# Altium project dakPCB.PrjPcb
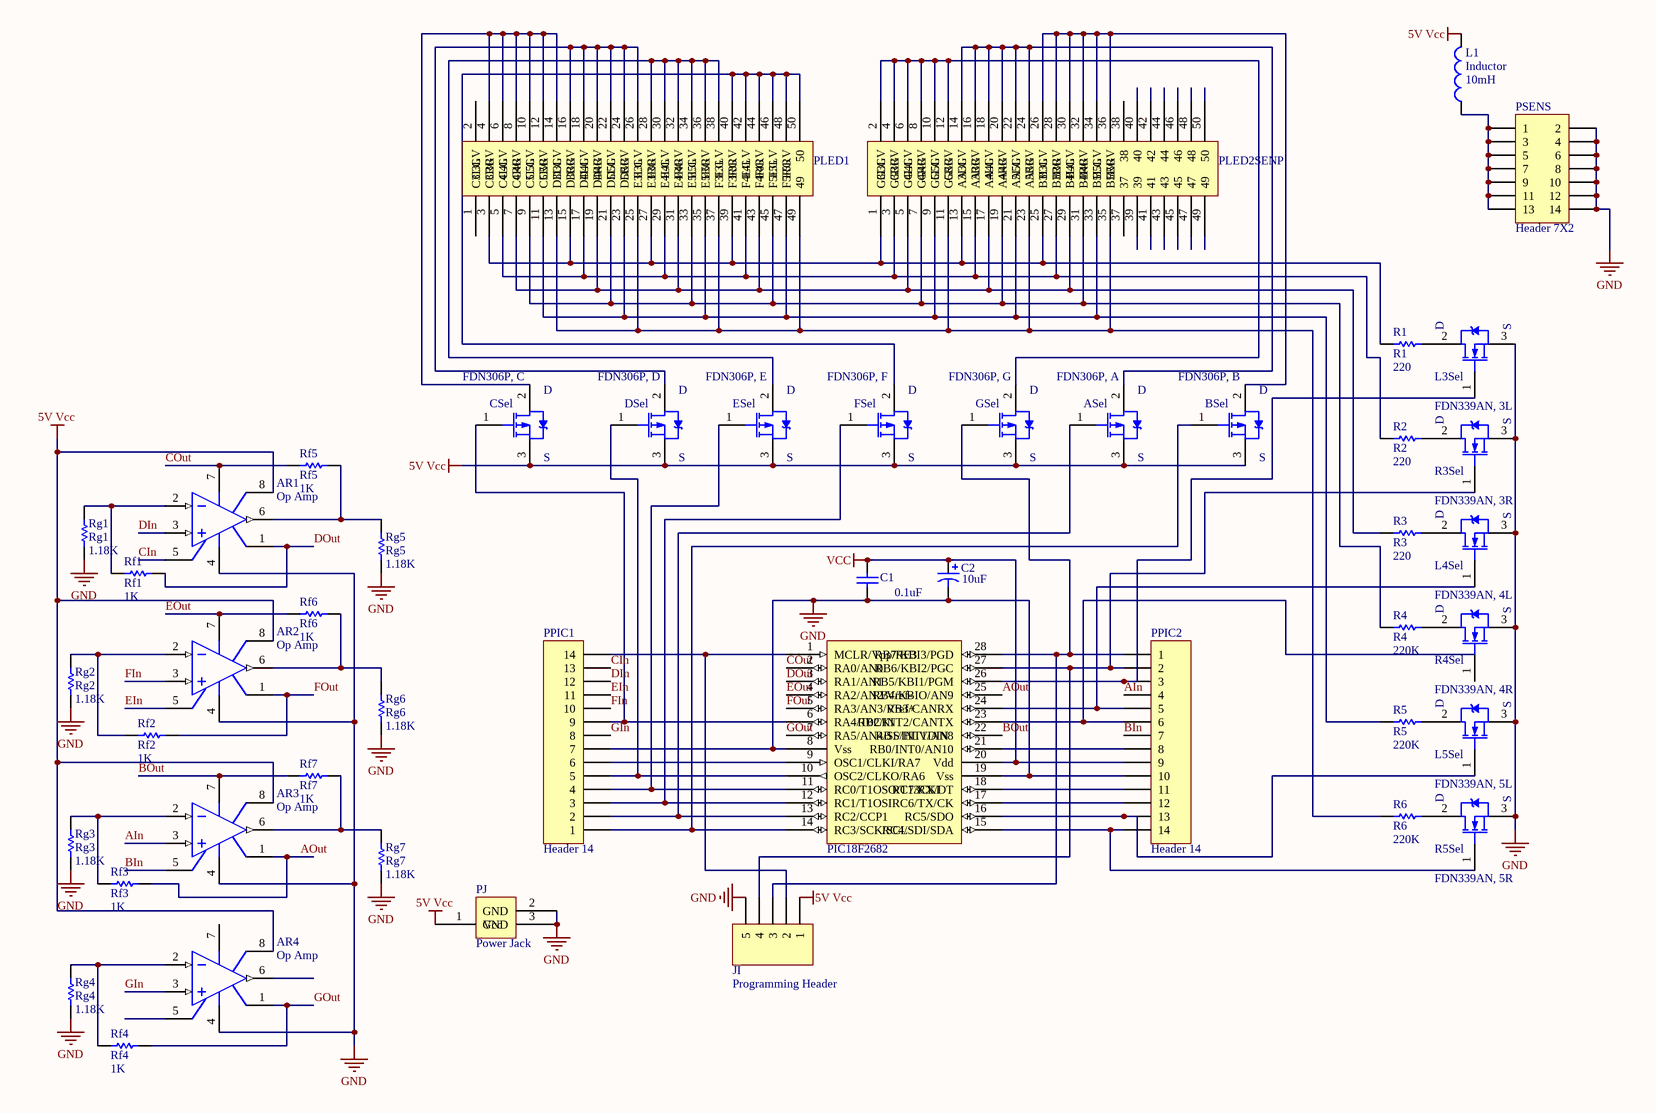
[diagram p0: pcblayout.SchDoc]
1 sheet, 48 parts. Net scope: global (net labels, ports and power ports of the same name join across sheets).
Board files: dakPCBNew.PcbDoc, Test.PcbDoc, dakPCB.PcbDoc

## Sheet pcblayout.SchDoc
size 457 x 241 mm

### Parts
AR1  Op Amp  [SOIC127P600X175-8N]
AR2  Op Amp  [SOIC127P600X175-8N]
AR3  Op Amp  [SOIC127P600X175-8N]
AR4  Op Amp  [SOIC127P600X175-8N]
ASel  FDN306P, A  [SOT23-3M]
BSel  FDN306P, B  [SOT23-3M]
C1  value 0.1uF  [CAPC2012M]  (hidden comment: Cap)
C2  value 10uF  [TC3216-1206]  (hidden comment: Cap Pol1)
CSel  FDN306P, C  [SOT23-3M]
DSel  FDN306P, D  [SOT23-3M]
ESel  FDN306P, E  [SOT23-3M]
FSel  FDN306P, F  [SOT23-3M]
GSel  FDN306P, G  [SOT23-3M]
JI  Programming Header  [HDR1X5]
L1  Inductor  value 10mH  [INDC2012M]
L3Sel  FDN339AN, 3L  [SOT23-3M]
L4Sel  FDN339AN, 4L  [SOT23-3M]
L5Sel  FDN339AN, 5L  [SOT23-3M]
PIC18F2682  PIC18F2682  [DIP28]  (value not drawn)
PJ  Power Jack  [BARREL JACK]
PLED1  50x2 Pin Header, PLED1  [HDR2X25]  (value not drawn)
PLED2SENP  50x2 Pin Header, PLED2SENP  [HDR2X25]  (value not drawn)
PPIC1  Header 14  [HDR1X14]
PPIC2  Header 14  [HDR1X14]
PSENS  Header 7X2  [HDR2X7]
R1  R1  value 220  [RESC2012M]
R2  R2  value 220  [RESC2012M]
R3  R3  value 220  [RESC2012M]
R3Sel  FDN339AN, 3R  [SOT23-3M]
R4  R4  value 220K  [RESC2012M]
R4Sel  FDN339AN, 4R  [SOT23-3M]
R5  R5  value 220K  [RESC2012M]
R5Sel  FDN339AN, 5R  [SOT23-3M]
R6  R6  value 220K  [RESC2012M]
Rf1  Rf1  value 1K  [RESC2012M]
Rf2  Rf2  value 1K  [RESC2012M]
Rf3  Rf3  value 1K  [RESC2012M]
Rf4  Rf4  value 1K  [RESC2012M]
Rf5  Rf5  value 1K  [RESC2012M]
Rf6  Rf6  value 1K  [RESC2012M]
Rf7  Rf7  value 1K  [RESC2012M]
Rg1  Rg1  value 1.18K  [RESC2012M]
Rg2  Rg2  value 1.18K  [RESC2012M]
Rg3  Rg3  value 1.18K  [RESC2012M]
Rg4  Rg4  value 1.18K  [RESC2012M]
Rg5  Rg5  value 1.18K  [RESC2012M]
Rg6  Rg6  value 1.18K  [RESC2012M]
Rg7  Rg7  value 1.18K  [RESC2012M]

### Nets
5V Vcc: AR1.8(TAB) AR2.8(TAB) AR3.8(TAB) AR4.8(TAB) ASel.3(S) BSel.3(S) CSel.3(S) DSel.3(S) ESel.3(S) FSel.3(S) GSel.3(S) JI.1 L1.2 PJ.1(Vcc)
GND: AR1.4(V-) AR2.4(V-) AR3.4(V-) AR4.4(V-) C1.1 C2.2 JI.5 L3Sel.3(S) L4Sel.3(S) L5Sel.3(S) PIC18F2682.8(Vss) PIC18F2682.19(Vss) PJ.2(GND) PJ.3(GND) PPIC1.7 PPIC2.10 PSENS.2 PSENS.4 PSENS.6 PSENS.8 PSENS.10 PSENS.12 PSENS.14 R3Sel.3(S) R4Sel.3(S) R5Sel.3(S) Rg1.1 Rg2.2 Rg3.1 Rg4.1 Rg5.1 Rg6.1 Rg7.1
VCC: C1.2 C2.1 PIC18F2682.20(Vdd) PPIC2.9
AIn: AR3.3(IN+) PPIC2.4
AOut: AR3.1(OS_NUL) PIC18F2682.25(RB4/KBIO/AN9) Rf3.2
BIn: AR3.5(OS_NUL) PPIC2.7
BOut: AR3.7(V+) PIC18F2682.22(RB1/INT1/AN8) Rf7.1
CIn: AR1.5(OS_NUL) PPIC1.13
COut: AR1.7(V+) PIC18F2682.2(RA0/AN0) Rf5.1
DIn: AR1.3(IN+) PPIC1.12
DOut: AR1.1(OS_NUL) PIC18F2682.3(RA1/AN1) Rf1.2
EIn: AR2.5(OS_NUL) PPIC1.11
EOut: AR2.7(V+) PIC18F2682.4(RA2/AN2/Vref-) Rf6.1
FIn: AR2.3(IN+) PPIC1.10
FOut: AR2.1(OS_NUL) PIC18F2682.5(RA3/AN3/Vref+) Rf2.2
GIn: AR4.3(IN+) PPIC1.8
GOut: AR4.1(OS_NUL) PIC18F2682.7(RA5/AN4/SS/HLVDIN) Rf4.2
NetAR1_2: AR1.2(IN-) Rf1.1 Rg1.2
NetAR1_6: AR1.6(OUT) Rf5.2 Rg5.2
NetAR2_2: AR2.2(IN-) Rf2.1 Rg2.1
NetAR2_6: AR2.6(OUT) Rf6.2 Rg6.2
NetAR3_2: AR3.2(IN-) Rf3.1 Rg3.2
NetAR3_6: AR3.6(OUT) Rf7.2 Rg7.2
NetAR4_2: AR4.2(IN-) Rf4.1 Rg4.2
NetASel_1: ASel.1(G) PIC18F2682.13(RC2/CCP1) PPIC1.2
NetASel_2: ASel.2(D) PLED2SENP.14(A3LV) PLED2SENP.16(A3RV) PLED2SENP.18(A4LV) PLED2SENP.20(A4RV) PLED2SENP.22(A5LV) PLED2SENP.24(A5RV)
NetBSel_1: BSel.1(G) PIC18F2682.14(RC3/SCK/SCL) PPIC1.1
NetBSel_2: BSel.2(D) PLED2SENP.26(B3LV) PLED2SENP.28(B3RV) PLED2SENP.30(B4LV) PLED2SENP.32(B4RV) PLED2SENP.34(B5LV) PLED2SENP.36(B5RV)
NetCSel_1: CSel.1(G) PIC18F2682.6(RA4/T0CKI) PPIC1.9
NetCSel_2: CSel.2(D) PLED1.4(C3RV) PLED1.6(C4LV) PLED1.8(C4RV) PLED1.10(C5LV) PLED1.12(C5RV) PLED1.14(D3LV)
NetDSel_1: DSel.1(G) PIC18F2682.10(OSC2/CLKO/RA6) PPIC1.5
NetDSel_2: DSel.2(D) PLED1.16(D3RV) PLED1.18(D4LV) PLED1.20(D4RV) PLED1.22(D5LV) PLED1.24(D5RV) PLED1.26(E3LV)
NetESel_1: ESel.1(G) PIC18F2682.11(RC0/T1OSO/T13CKI) PPIC1.4
NetESel_2: ESel.2(D) PLED1.28(E3RV) PLED1.30(E4LV) PLED1.32(E4RV) PLED1.34(E5LV) PLED1.36(E5RV) PLED1.38(F3LV)
NetFSel_1: FSel.1(G) PIC18F2682.12(RC1/T1OSI) PPIC1.3
NetFSel_2: FSel.2(D) PLED1.40(F3RV) PLED1.42(F4LV) PLED1.44(F4RV) PLED1.46(F5LV) PLED1.48(F5RV) PLED1.50
NetGSel_1: GSel.1(G) JI.3 PIC18F2682.28(RB7/KBI3/PGD) PPIC2.1
NetGSel_2: GSel.2(D) PLED2SENP.2(G3LV) PLED2SENP.4(G3RV) PLED2SENP.6(G4LV) PLED2SENP.8(G4RV) PLED2SENP.10(G5LV) PLED2SENP.12(G5RV)
NetJI_2: JI.2 PIC18F2682.1(MCLR/Vpp/RE3) PPIC1.14
NetJI_4: JI.4 PIC18F2682.27(RB6/KBI2/PGC) PPIC2.2 R3Sel.1(G)
NetL1_1: L1.1 PSENS.1 PSENS.3 PSENS.5 PSENS.7 PSENS.9 PSENS.11 PSENS.13
NetL3Sel_1: L3Sel.1(G) PIC18F2682.26(RB5/KBI1/PGM) PPIC2.3
NetL3Sel_2: L3Sel.2(D) R1.2
NetL4Sel_1: L4Sel.1(G) PIC18F2682.24(RB3/CANRX) PPIC2.5
NetL4Sel_2: L4Sel.2(D) R3.2
NetL5Sel_1: L5Sel.1(G) PIC18F2682.16(RC5/SDO) PPIC2.13
NetL5Sel_2: L5Sel.2(D) R5.2
NetPIC18F2682_9: PIC18F2682.9(OSC1/CLKI/RA7) PPIC1.6
NetPIC18F2682_15: PIC18F2682.15(RC4/SDI/SDA) PPIC2.14 R5Sel.1(G)
NetPIC18F2682_17: PIC18F2682.17(RC6/TX/CK) PPIC2.12
NetPIC18F2682_18: PIC18F2682.18(RC7/RX/DT) PPIC2.11
NetPIC18F2682_21: PIC18F2682.21(RB0/INT0/AN10) PPIC2.8
NetPIC18F2682_23: PIC18F2682.23(RB2/INT2/CANTX) PPIC2.6
NetPLED1_3: PLED1.3(C3RG) PLED1.15(D3RG) PLED1.27(E3RG) PLED1.39(F3RG) PLED2SENP.1(G3LG) PLED2SENP.13(A3LG) PLED2SENP.25(B3LG) R1.1
NetPLED1_5: PLED1.5(C4LG) PLED1.17(D4LG) PLED1.29(E4LG) PLED1.41(F4LG) PLED2SENP.3(G3RG) PLED2SENP.15(A3RG) PLED2SENP.27(B3RG) R2.1
NetPLED1_7: PLED1.7(C4RG) PLED1.19(D4RG) PLED1.31(E4RG) PLED1.43(F4RG) PLED2SENP.5(G4LG) PLED2SENP.17(A4LG) PLED2SENP.29(B4LG) R3.1
NetPLED1_9: PLED1.9(C5LG) PLED1.21(D5LG) PLED1.33(E5LG) PLED1.45(F5LG) PLED2SENP.7(G4RG) PLED2SENP.19(A4RG) PLED2SENP.31(B4RG) R4.1
NetPLED1_11: PLED1.11(C5RG) PLED1.23(D5RG) PLED1.35(E5RG) PLED1.47(F5RG) PLED2SENP.9(G5LG) PLED2SENP.21(A5LG) PLED2SENP.33(B5LG) R5.1
NetPLED1_13: PLED1.13(D3LG) PLED1.25(E3LG) PLED1.37(F3LG) PLED1.49 PLED2SENP.11(G5RG) PLED2SENP.23(A5RG) PLED2SENP.35(B5RG) R6.1
NetR2_2: R2.2 R3Sel.2(D)
NetR4_2: R4.2 R4Sel.2(D)
NetR5Sel_2: R5Sel.2(D) R6.2

Not connected (* = marked no-connect by the designer): AR4 5(OS_NUL) 6(OUT) 7(V+); PLED1 1(C3LG) 2(C3LV); PLED2SENP 37 38 39 40 41 42 43 44 45 46 47 48 49 50; R4Sel 1(G)

### Library data of the parts
AR1-AR4 = Op Amp: FET Operational Amplifier; Published: 8-Jun-2000; LatestRevisionDate: 17-Jul-2002; LatestRevisionNote: Re-released for DXP Platform.; DatasheetVersion: REV. B; PackageVersion: 1990; PackageReference: H-08A; Publisher: Altium Limited; PackageDescription: Can; 8 Leads; Pin Circle Dia. 5.08 mm; Lead Dia. 0.53 mm (max); ComponentLink1Description: Manufacturer Link; ComponentLink1URL: http://www.analog.com/
ASel BSel CSel DSel ESel FSel GSel = FDN304P: Pch MOSFET
C1 = Cap: Capacitor; Published: 8-Jun-2000; LatestRevisionDate: 17-Jul-2002; LatestRevisionNote: Re-released for DXP Platform.; PackageReference: RAD-0.3; Publisher: Altium Limited; PackageDescription: Radial Cap, Thru-Hole; 2 Leads; 0.3 in Pin Spacing
C2 = Cap Pol1: Polarized Capacitor (Radial); Published: 8-Jun-2000; LatestRevisionDate: 17-Jul-2002; LatestRevisionNote: Re-released for DXP Platform.; PackageReference: RB7.6-15; Publisher: Altium Limited; PackageDescription: Polarized Capacitor (Radial); 2 Leads
JI = Header 5: Header, 5-Pin; LatestRevisionDate: 17-Jul-2002; LatestRevisionNote: Re-released for DXP Platform.; Publisher: Altium Limited
L1 = Inductor: Code_IEC: 1005; Published: 8-Jun-2000; LatestRevisionDate: 29-May-2009; LatestRevisionNote: IPC-7351 Footprint Added.; PackageReference: 0402-A; Publisher: Altium Limited; PackageDescription: Chip Inductor; Code_JEITA: 0402
L3Sel L4Sel L5Sel R3Sel R4Sel R5Sel = FDN339AN: Nch MOSFET
PPIC1 PPIC2 = Header 14: Header, 14-Pin; LatestRevisionDate: 17-Jul-2002; LatestRevisionNote: Re-released for DXP Platform.; Publisher: Altium Limited
PSENS = Header 7X2: Header, 7-Pin, Dual row; LatestRevisionDate: 17-Jul-2002; LatestRevisionNote: Re-released for DXP Platform.; Publisher: Altium Limited
R1-R6 Rf1-Rf7 Rg1-Rg7 = Res1: Resistor; Published: 8-Jun-2000; LatestRevisionDate: 17-Jul-2002; LatestRevisionNote: Re-released for DXP Platform.; PackageReference: AXIAL-0.3; Publisher: Altium Limited; PackageDescription: Axial Device, Thru-Hole; 2 Leads; 0.3 in Pin Spacing